# EAGLE design DIP_REFLOW (EAGLE 6.4)
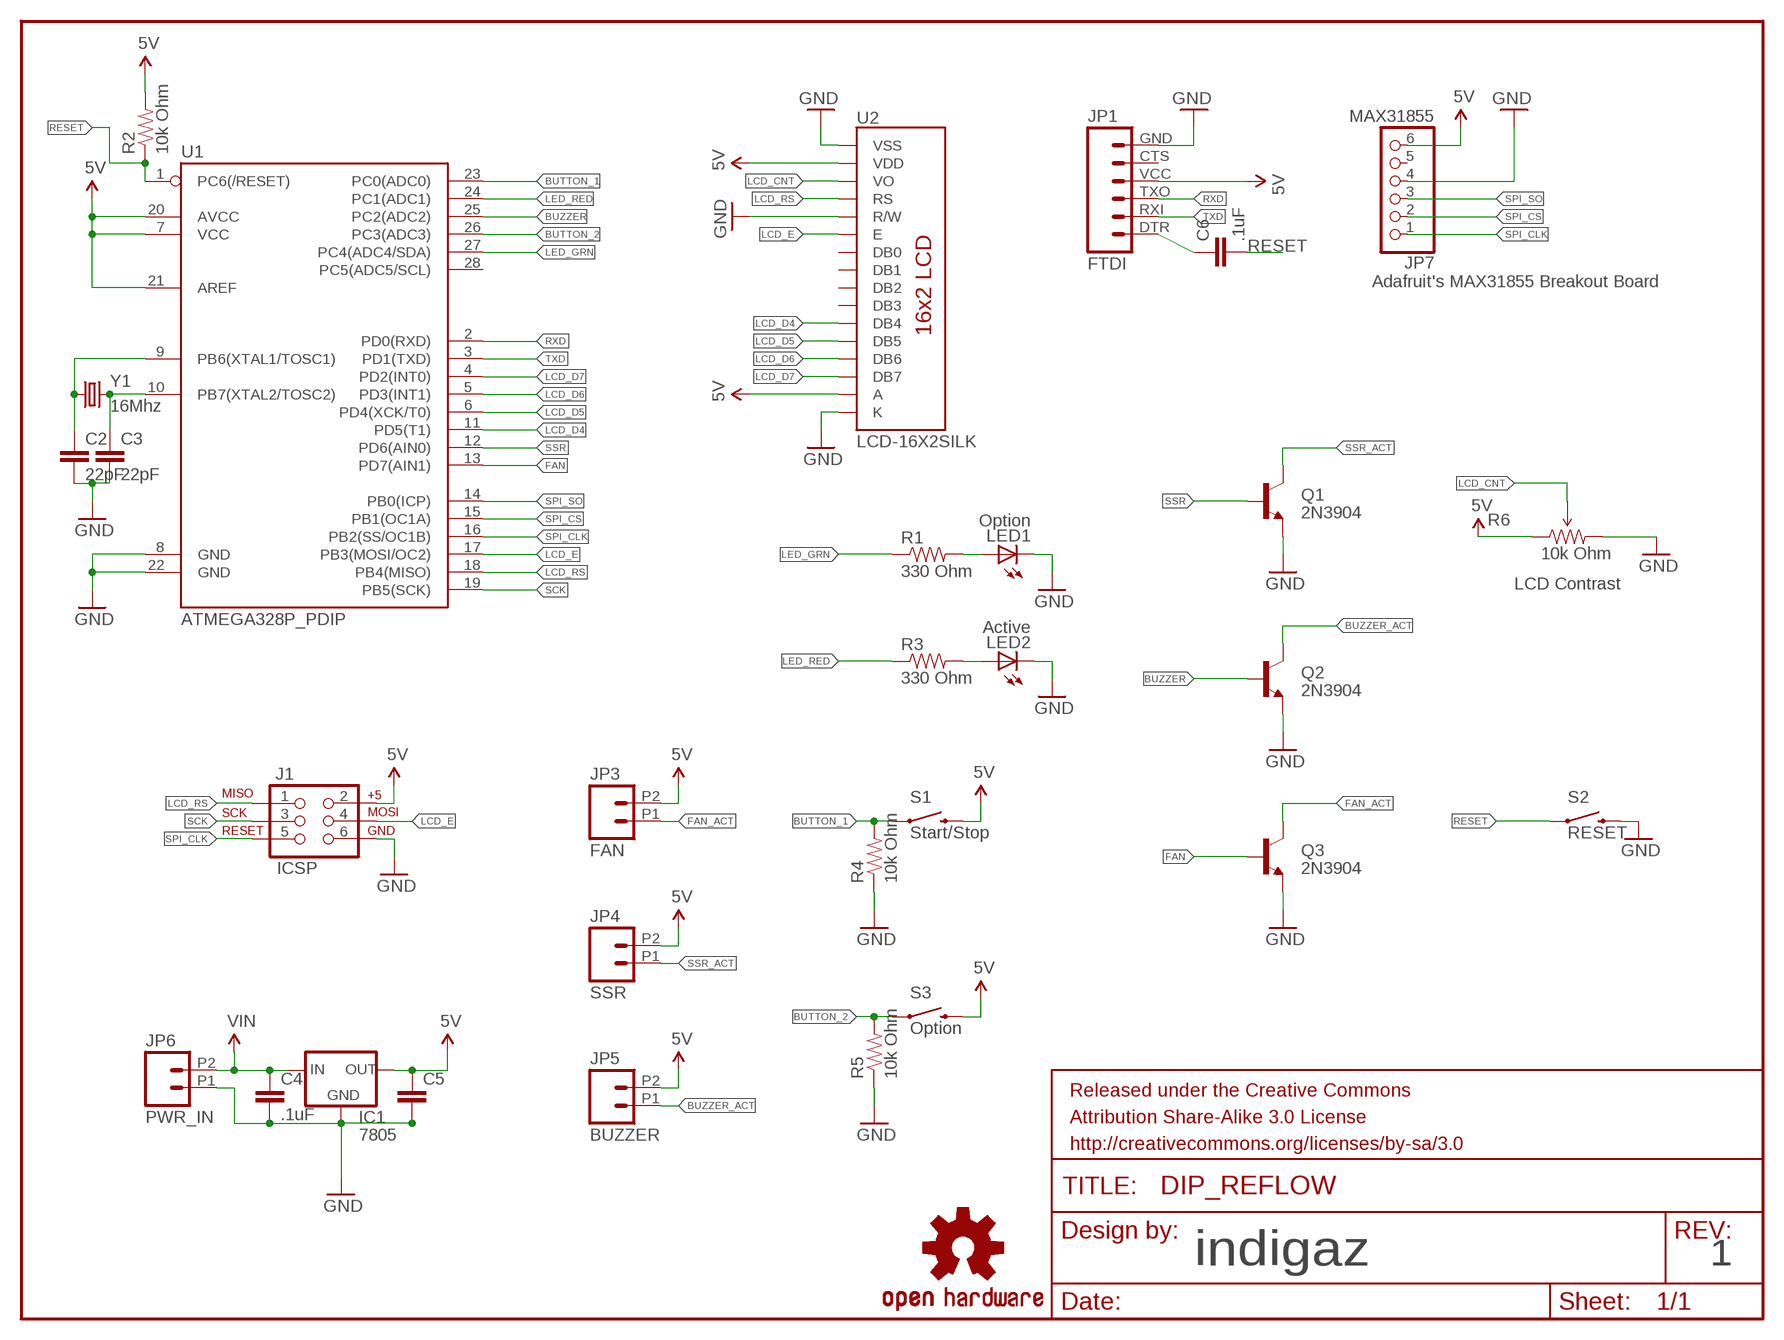
[diagram p0: schematic, sheet 1]

## Parts
C2  22pF  CAPPTH1  [CAP-PTH-5MM]
C3  22pF  CAPPTH1  [CAP-PTH-5MM]
C4  .1uF  CAPPTH1  [CAP-PTH-5MM]
C5  CAPPTH1  [CAP-PTH-5MM]
C6  .1uF  CAPPTH1  [CAP-PTH-5MM]
FRAME1  FRAME-LETTER  [CREATIVE_COMMONS]
IC1  7805  V_REG_78XX-TO-220  [TO-220-ALT]
J1  ICSP  AVR_SPI_PRG_6PTH  [2X3]
JP1  FTDI  FTDI_BASICPTH  [FTDI_BASIC]
JP3  FAN  M022.54MM_SCREWTERM  [1X02_2.54_SCREWTERM]
JP4  SSR  M022.54MM_SCREWTERM  [1X02_2.54_SCREWTERM]
JP5  BUZZER  M022.54MM_SCREWTERM  [1X02_2.54_SCREWTERM]
JP6  PWR_IN  M022.54MM_SCREWTERM  [1X02_2.54_SCREWTERM]
JP7  MAX31855  PINHD-1X6  [1X06]
LED1  Option  LED5MM  [LED5MM]
LED2  Active  LED5MM  [LED5MM]
LOGO1  OSHW-LOGOL  [OSHW-LOGO-L]
Q1  2N3904  TRANSISTOR_NPNTO-92-AMMO  [TO-92-AMMO]
Q2  2N3904  TRANSISTOR_NPNTO-92-AMMO  [TO-92-AMMO]
Q3  2N3904  TRANSISTOR_NPNTO-92-AMMO  [TO-92-AMMO]
R1  330 Ohm  RESISTORPTH-1/4W  [AXIAL-0.4]
R2  10k Ohm  RESISTORPTH-1/4W  [AXIAL-0.4]
R3  330 Ohm  RESISTORPTH-1/4W  [AXIAL-0.4]
R4  10k Ohm  RESISTORPTH-1/4W  [AXIAL-0.4]
R5  10k Ohm  RESISTORPTH-1/4W  [AXIAL-0.4]
R6  10k Ohm  TRIMPOT-PTH-KNOB  [3386U]
S1  Start/Stop  SWITCH-MOMENTARY-2PTH  [TACTILE-PTH]
S2  RESET  SWITCH-MOMENTARY-2PTH  [TACTILE-PTH]
S3  Option  SWITCH-MOMENTARY-2PTH  [TACTILE-PTH]
U1  ATMEGA328P_PDIP  [DIL28-3]
U2  LCD-16X2SILK  [LCD-16X2]
Y1  16Mhz  CRYSTALHC49US  [HC49US]

## Nets
5V: C5.1 IC1.OUT J1.2 JP1.VCC JP3.P2 JP4.P2 JP5.P2 JP7.6 R2.P$2 R6.1(CCW) S1.3 S3.3 U1.7(VCC) U1.20(AVCC) U1.21(AREF) U2.2(VDD) U2.15(A)
BUTTON_1: R4.P$2 S1.1 U1.23(PC0(ADC0))
BUTTON_2: R5.P$2 S3.1 U1.26(PC3(ADC3))
BUZZER: Q2.2(B) U1.25(PC2(ADC2))
BUZZER_ACT: JP5.P1 Q2.3(C)
FAN: Q3.2(B) U1.13(PD7(AIN1))
FAN_ACT: JP3.P1 Q3.3(C)
GND: C2.2 C3.2 C4.2 C5.2 IC1.GND J1.6 JP1.GND JP6.P1 JP7.4 LED1.K(C) LED2.K(C) Q1.1(E) Q2.1(E) Q3.1(E) R4.P$1 R5.P$1 R6.3(CW) S2.3 U1.8(GND) U1.22(GND) U2.1(VSS) U2.5(R/W) U2.16(K)
LCD_CNT: R6.2(WIPER) U2.3(VO)
LCD_D4: U1.11(PD5(T1)) U2.11(DB4)
LCD_D5: U1.6(PD4(XCK/T0)) U2.12(DB5)
LCD_D6: U1.5(PD3(INT1)) U2.13(DB6)
LCD_D7: U1.4(PD2(INT0)) U2.14(DB7)
LCD_E: J1.4 U1.17(PB3(MOSI/OC2)) U2.6(E)
LCD_RS: J1.1 U1.18(PB4(MISO)) U2.4(RS)
LED_GRN: R1.P$1 U1.27(PC4(ADC4/SDA))
LED_RED: R3.P$1 U1.24(PC1(ADC1))
N$1: C6.1 JP1.DTR
N$2: C2.1 U1.9(PB6(XTAL1/TOSC1)) Y1.1
N$3: LED1.A R1.P$2
N$4: C3.1 U1.10(PB7(XTAL2/TOSC2)) Y1.2
N$5: LED2.A R3.P$2
RESET: C6.2 R2.P$1 S2.1 U1.1(PC6(/RESET))
RXD: JP1.TXO U1.2(PD0(RXD))
SCK: J1.3 U1.19(PB5(SCK))
SPI_CLK: J1.5 JP7.1 U1.16(PB2(SS/OC1B))
SPI_CS: JP7.2 U1.15(PB1(OC1A))
SPI_SO: JP7.3 U1.14(PB0(ICP))
SSR: Q1.2(B) U1.12(PD6(AIN0))
SSR_ACT: JP4.P1 Q1.3(C)
TXD: JP1.RXI U1.3(PD1(TXD))
VIN: C4.1 IC1.IN JP6.P2
Unconnected: JP1.CTS JP7.5 U1.28(PC5(ADC5/SCL)) U2.7(DB0) U2.8(DB1) U2.9(DB2) U2.10(DB3)

## Notes on the sheet
- Adafruit's MAX31855 Breakout Board
- LCD Contrast
- indigaz | 1

## Library data of the parts
C2-C6 = SparkFun-Capacitors:CAP: Capacitor Standard 0603 ceramic capacitor, and 0.1" leaded capacitor.
FRAME1 = SparkFun-Aesthetics:FRAME-LETTER: Schematic Frame Standard 8.5x11 US Letter frame
IC1 = SparkFun-PowerIC:V_REG_78XX: Voltage Regulator Standard 7805 5V regulator. IGO (Input Ground Output). Spark Fun Electronics SKU : COM-00107
J1 = SparkFun-Connectors:AVR_SPI_PRG_6: AVR ISP 6 Pin This is the reduced ISP connector for AVR programming. Common on Arduino. This footprint will take up less PCB space and can be used with a 10-pin to 6-pin adapter such as SKU: BOB-08508
JP1 = SparkFun-Connectors:FTDI_BASIC: FTDI Basic header with labels
JP3-JP6 = SparkFun-Connectors:M02: Standard 2-pin 0.1" header. Use with - straight break away headers ( PRT-00116) - right angle break away headers (PRT-00553) - swiss pins (PRT-00743) - machine pins (PRT-00117) - female headers (PRT-00115) Molex polarized connector foot print use with: PRT-08233 with associated crimp pins and housings. 2.54_SCREWTERM for use with PRT-10571. 3.5mm Screw Terminal footprints for PRT-08084 5mm Screw Terminal footprints for use with PRT-08433
JP7 = adafruit:PINHD-1X6: PIN HEADER
LED1 LED2 = SparkFun-LED:LED: LEDs Standard schematic elements and footprints for 5mm, 3mm, 1206, and 0603 sized LEDs. 5mm - Spark Fun Electronics SKU : COM-00529 (and others)
LOGO1 = SparkFun-Aesthetics:OSHW-LOGO: Open Source Hardware Logo This logo indicates the piece of hardware it is found on incorporates a OSHW license and/or adheres to the definition of open source hardware found here: http://freedomdefined.org/OSHW
Q1-Q3 = SparkFun-DiscreteSemi:TRANSISTOR_NPN: Generic NPN BJT MMBT2222A - TRANS-08049 (SOT-23, 1A 40V) MPSA42 - TRANS-09116 (SOT-23, 500mA 300V) MMBT5088LT1G - TRANS-11160 (SOT-23, 50 mA 30V)
R1-R5 = SparkFun-Resistors:RESISTOR: Resistor Basic schematic elements and footprints for 0603, 1206, and PTH resistors.
R6 = SparkFun-Electromechanical:TRIMPOT: Various small potentiometers for "set-and-forget" applications
S1-S3 = SparkFun-Electromechanical:SWITCH-MOMENTARY-2: Various NO switches- pushbuttons, reed, etc
U1 = SparkFun-DigitalIC:ATMEGA328P_PDIP: uC used in the Arduino 32kb flash, 1k EEPROM, 2k SRAM This is the through-hole version of this chip.
U2 = SparkFun-Displays:LCD-16X2: Standard text-only 16x2 parallel input LCD
Y1 = SparkFun-FreqCtrl:CRYSTAL: Various standard crystals. Proven footprints. Spark Fun Electronics SKU : COM-00534

## Net classes
0 default: width 0.305 mm, drill 0.508 mm, clearance 0.254 mm

## Board
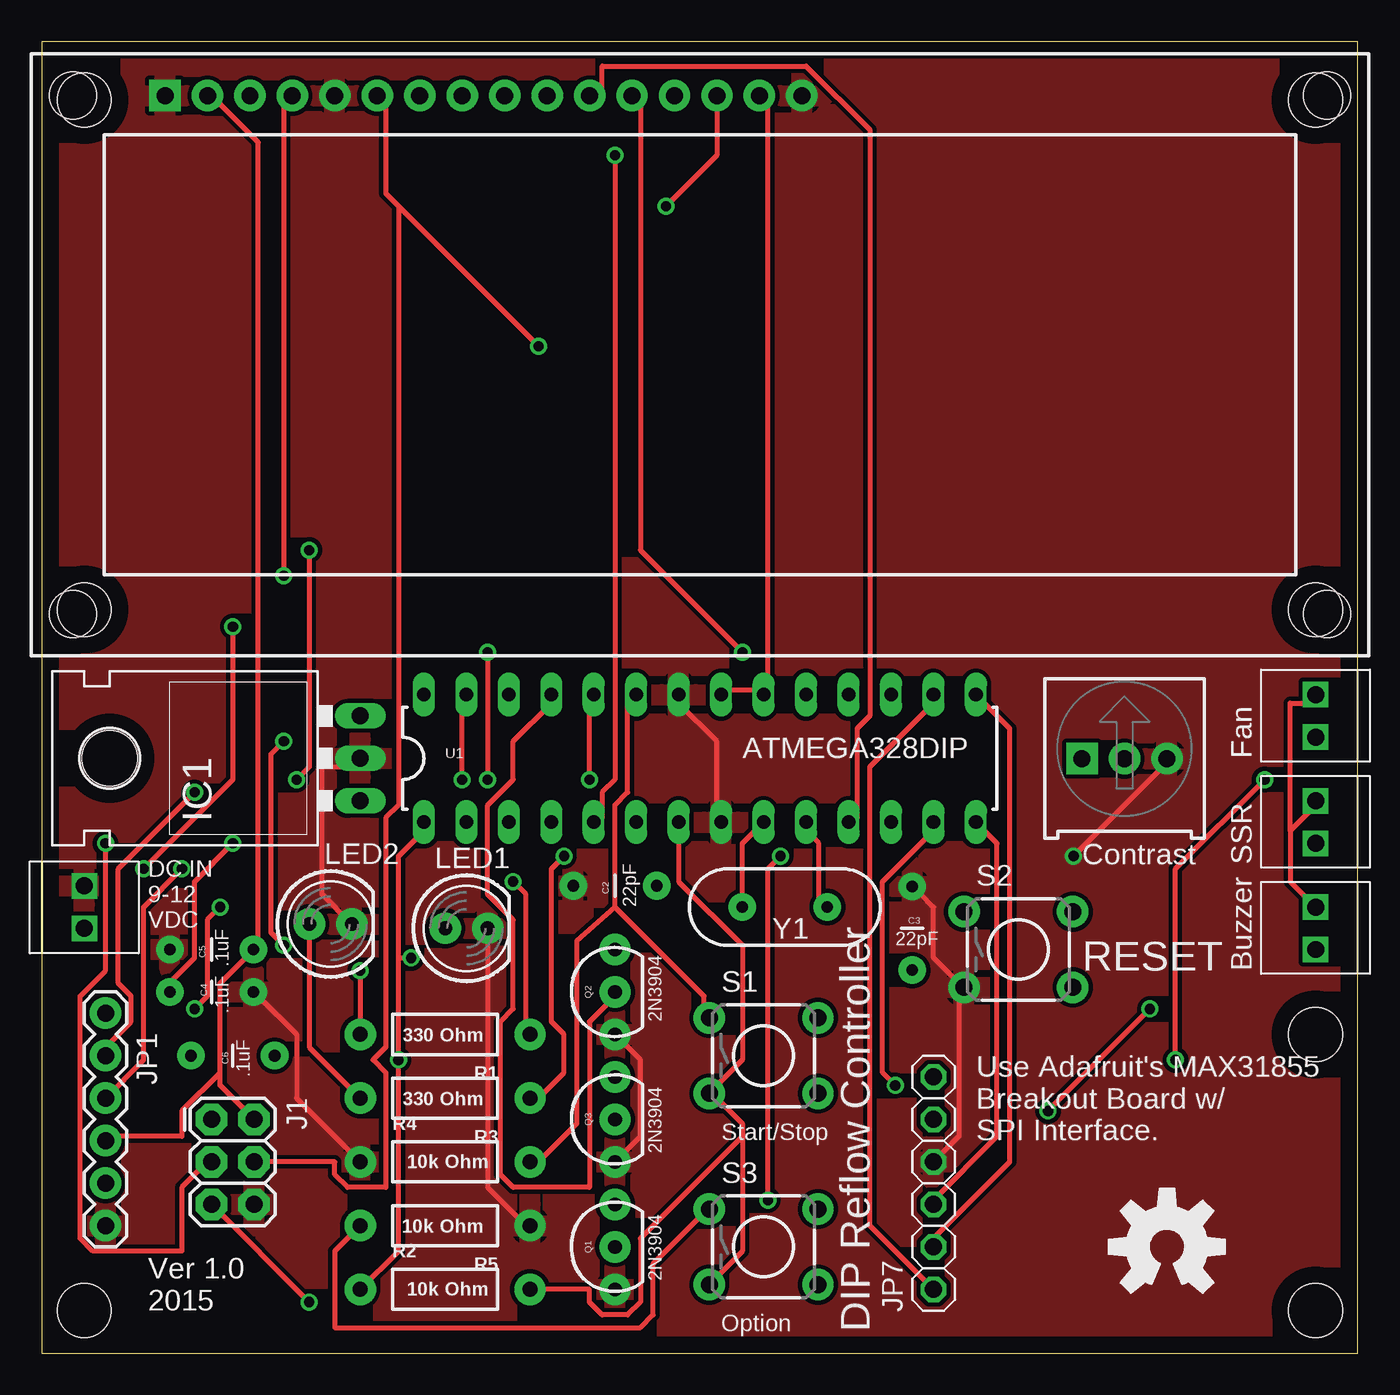
[diagram p1: board, top side]
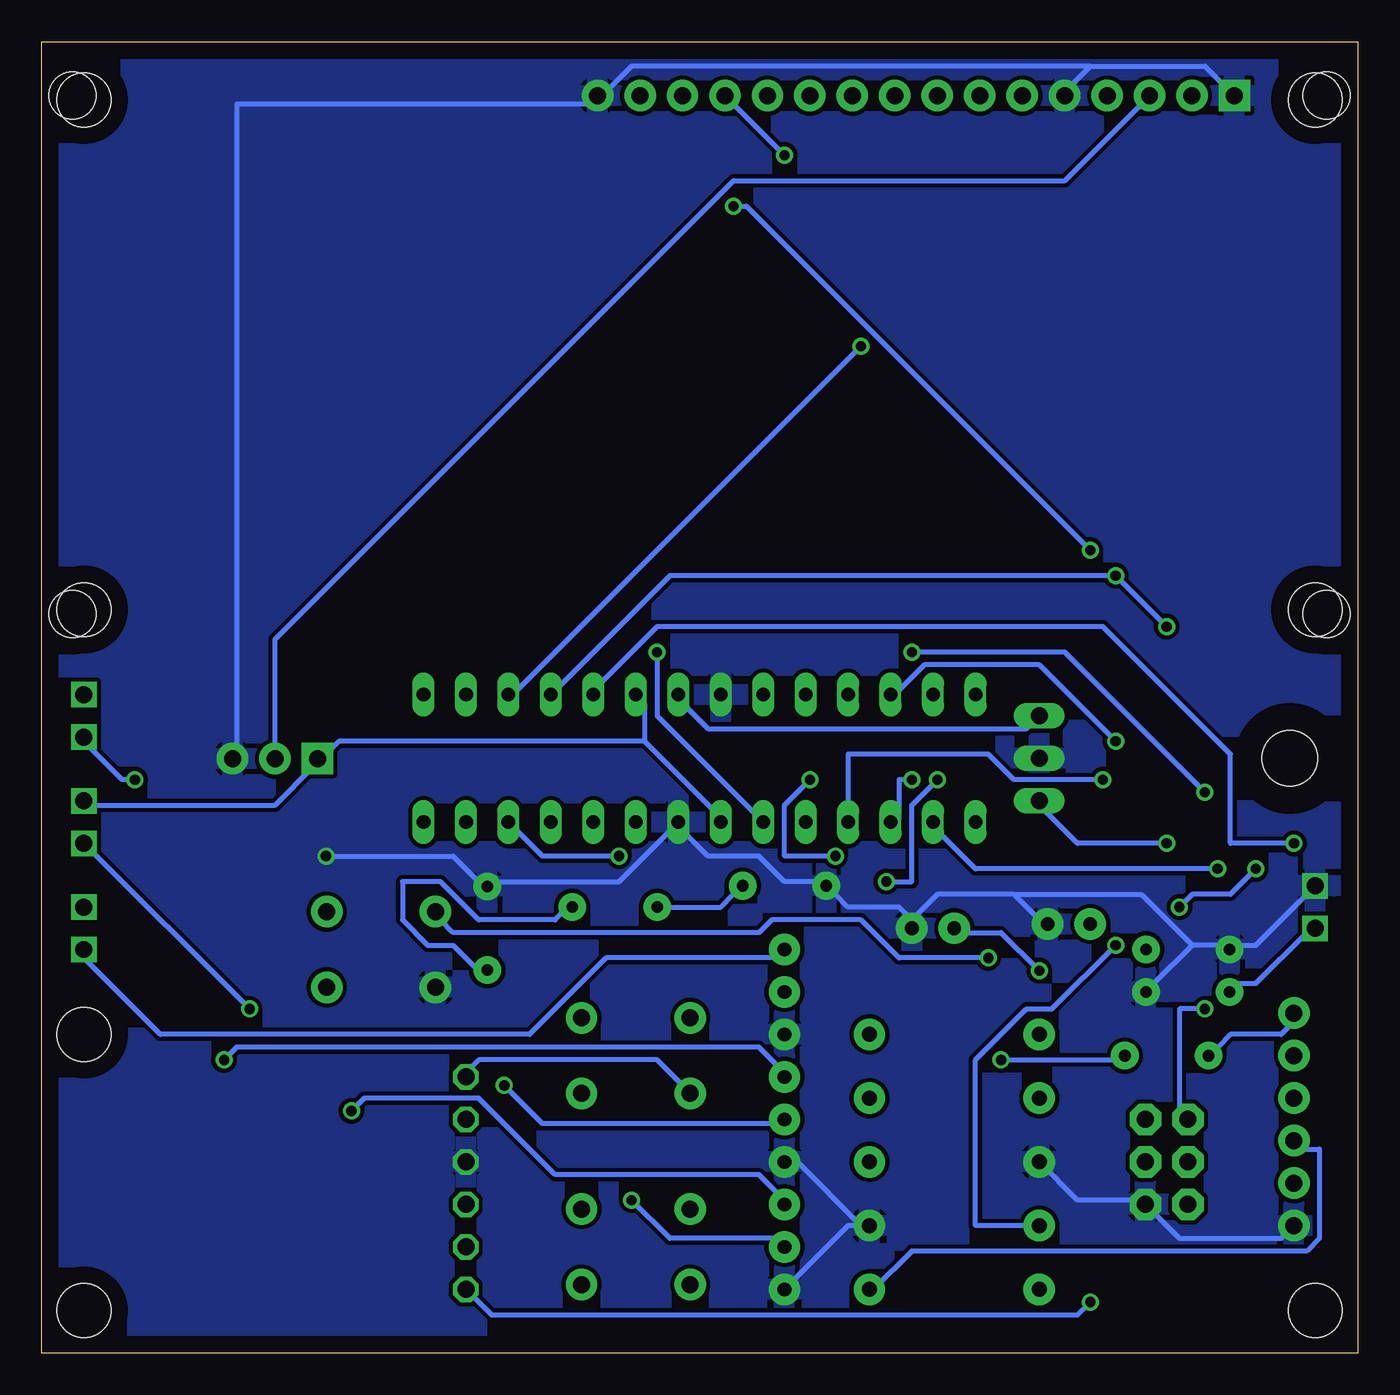
[diagram p2: board, bottom side, seen from below]

Size 78.72 x 78.41 mm. Coordinates in mm from the lower left corner, seen from the top.
Outline: 0,0 78.72,0 78.72,78.41 0,78.41 0,0
Copper layers (1*16): Top 0.035mm / dielectric 1.5mm / Bottom 0.035mm
Design rules "default *": minimum track width 10mil, minimum drill 20mil, track to track 8mil, track to pad 8mil, pad to pad 8mil, via to via 8mil, smd to smd 8mil, copper to edge 40mil, drill to drill 8mil, minimum pad ring 10mil, minimum via ring 8mil, stop-mask expansion 4mil, vias tented up to drill 0mil, thermal gap 10mil
Holes 3.2 mm at 2.54,2.54 76.2,2.54 76.2,74.93 2.54,74.93 2.54,44.45 76.2,44.45 76.2,19.05

### Footprints (pad centres in the part's own frame; a part is rotated, then mirrored left to right if it is on the bottom)
CAP-PTH-5MM = drill 0.7 pad 1.651: 1 -2.5,0; 2 2.5,0
TO-220-ALT = drill 1.016 long: GND 0,-3.81; IN -2.54,-3.81; OUT 2.54,-3.81 | hole 3.302: 0,11.176
2X3 = drill 1.016 pad 1.88 octagon: 1 0,0; 2 0,2.54; 3 2.54,0; 4 2.54,2.54; 5 5.08,0; 6 5.08,2.54
FTDI_BASIC = drill 1.016 pad 1.88: CTS 10.16,0; DTR 0,0; GND 12.7,0; RXI 2.54,0; TXO 5.08,0; VCC 7.62,0
1X02_2.54_SCREWTERM = drill 1.016 square: P1 2.54,0; P2 0,0
1X06 = drill 1.016 octagon: 1 -6.35,0; 2 -3.81,0; 3 -1.27,0; 4 1.27,0; 5 3.81,0; 6 6.35,0
LED5MM = drill 0.813 pad 1.88: A -1.27,0; K 1.27,0
TO-92-AMMO = drill 0.813 pad 1.88: 1 -2.54,0; 2 0,0; 3 2.54,0
AXIAL-0.4 = drill 0.9 pad 1.88: P$1 -5.08,0; P$2 5.08,0
3386U = drill 1.016 pad 1.88 square: 1 -2.54,-0.015 | drill 1.016 pad 1.88: 2 0,-0.015; 3 2.54,-0.015
TACTILE-PTH = drill 1.016 pad 1.88: 1 -3.251,2.261; 2 3.251,2.261; 3 -3.251,-2.261; 4 3.251,-2.261
DIL28-3 = drill 0.813 long: 1 -16.51,-3.81; 2 -13.97,-3.81; 3 -11.43,-3.81; 4 -8.89,-3.81; 5 -6.35,-3.81; 6 -3.81,-3.81; 7 -1.27,-3.81; 8 1.27,-3.81; 9 3.81,-3.81; 10 6.35,-3.81; 11 8.89,-3.81; 12 11.43,-3.81; 13 13.97,-3.81; 14 16.51,-3.81; 15 16.51,3.81; 16 13.97,3.81; 17 11.43,3.81; 18 8.89,3.81; 19 6.35,3.81; 20 3.81,3.81; 21 1.27,3.81; 22 -1.27,3.81; 23 -3.81,3.81; 24 -6.35,3.81; 25 -8.89,3.81; 26 -11.43,3.81; 27 -13.97,3.81; 28 -16.51,3.81
LCD-16X2 = drill 1.016 pad 1.88 square: 1 -32,15.5 | drill 1.016 pad 1.88: 2 -29.46,15.5; 3 -26.92,15.5; 4 -24.38,15.5; 5 -21.84,15.5; 6 -19.3,15.5; 7 -16.76,15.5; 8 -14.22,15.5; 9 -11.68,15.5; 10 -9.14,15.5; 11 -6.6,15.5; 12 -4.06,15.5; 13 -1.52,15.5; 14 1.02,15.5; 15 3.56,15.5; 16 6.1,15.5 | hole 2.8: -37.5,15.5; -37.5,-15.5; 37.5,15.5; 37.5,-15.5
HC49US = drill 0.7 pad 1.651: 1 -2.54,0; 2 2.54,0

### Placement (x,y rotation side)
C2  34.29,27.94 180 top
C3  52.07,25.4 90 top
C4  10.16,21.59 0 top
C5  10.16,24.13 180 top
C6  11.43,17.78 0 top
FRAME1  20.32,-7.62 0 top  (outside the outline)
IC1  15.24,35.56 90 top
J1  10.16,13.97 270 top
JP1  3.81,20.32 270 top
JP3  76.2,39.37 270 top
JP4  76.2,33.02 270 top
JP5  76.2,26.67 270 top
JP6  2.54,25.4 90 top
JP7  53.34,10.16 90 top
LED1  25.4,25.4 0 top
LED2  17.27,25.65 0 top
LOGO1  67.31,6.35 0 top
Q1  34.29,6.35 90 top
Q2  34.29,21.59 90 top
Q3  34.29,13.97 90 top
R1  24.13,19.05 180 top
R2  24.13,3.81 0 top
R3  24.13,15.24 180 top
R4  24.13,11.43 0 top
R5  24.13,7.62 180 top
R6  64.77,35.56 0 top
S1  43.18,17.78 0 top
S2  58.42,24.13 0 top
S3  43.18,6.35 0 top
U1  39.37,35.56 0 top
U2  39.37,59.69 0 top
Y1  44.45,26.67 0 top

### Tracks (layer width: path | path; a pad name or v marks a point on that pad's centre or on a via)
5V
  Top 0.305: 10.67,16.76 10.67,16 J1.2 | 10.67,16.76 10.67,22.1 12.19,23.62 C5.1 12.95,24.38 12.95,72.39 10.67,74.68 U2.2 | 10.67,16.76 8.38,14.48 8.38,12.95 3.81,12.95 JP1.VCC | JP5.P2 74.68,28.19 74.68,31.24 | 74.68,31.24 76.2,32.77 JP4.P2 | 74.68,31.24 74.68,38.86 76.2,38.86 JP3.P2 | 41.91,12.95 41.91,13.72 40.39,15.24 S1.3 40.39,16 41.91,17.53 41.91,24.38 38.1,28.19 U1.7 | 41.91,12.95 41.91,6.1 40.39,4.57 S3.3 | U1.21 41.15,39.62 42.67,39.62 U1.20 43.43,39.62 43.43,74.68 U2.15 | R2.P$2 32.77,3.81 32.77,3.05 33.53,2.29 35.05,2.29 35.81,3.05 35.81,6.86 41.91,12.95
  Bottom 0.305: R2.P$2 28.96,3.81 26.67,6.1 3.05,6.1 2.29,6.86 2.29,12.19 3.81,12.19 JP1.VCC | JP4.P2 76.2,32.77 64.77,32.77 62.48,35.05 R6.1 61.72,35.81 60.96,36.58 42.67,36.58 | JP7.6 53.34,16.76 52.58,17.53 41.91,17.53 40.39,16 S1.3 | 42.67,36.58 38.1,32 U1.7 | 42.67,36.58 42.67,38.86 U1.20 | IC1.OUT 19.81,37.34 38.86,37.34 40.39,38.86 U1.21
BUTTON_1
  Top 0.305: 34.29,26.67 34.29,32.77 35.05,33.53 35.05,38.86 U1.23 | 34.29,26.67 39.62,21.34 39.62,20.57 S1.1 | 34.29,26.67 32,24.64 32,13.72 29.72,11.43 R4.P$2
BUTTON_2  (via drill 0.61)
  Top 0.305: v14.48,36.58 13.72,35.81 13.72,25.15 v14.48,24.38 | R5.P$2 17.53,6.1 17.53,1.52 35.81,1.52 36.58,2.29 36.58,5.33 39.62,8.38 S3.1
  Bottom 0.305: v14.48,36.58 19.05,41.15 25.91,41.15 27.43,39.62 U1.26 | v14.48,24.38 18.29,20.57 19.81,20.57 22.86,17.53 22.86,7.62 R5.P$2
BUZZER
  Top 0.305: U1.25 30.48,38.86 28.19,36.58 28.19,34.29 26.67,32.77 26.67,27.43 28.19,25.91 28.19,20.57 27.43,19.81 27.43,10.67 28.19,9.91 32.77,9.91 32.77,19.81 34.29,21.34 Q2.2
BUZZER_ACT
  Bottom 0.305: JP5.P1 76.2,23.62 71.63,19.05 49.53,19.05 44.96,23.62 34.29,23.62 Q2.3
FAN  (via drill 0.61)
  Top 0.305: v51.05,16 50.29,16.76 50.29,28.19 53.34,31.24 U1.13
  Bottom 0.305: v51.05,16 48.77,13.72 34.29,13.72 Q3.2
FAN_ACT  (via drill 0.61)
  Top 0.305: v73.15,34.29 67.82,28.96 v67.82,17.53
  Bottom 0.305: v73.15,34.29 73.91,34.29 76.2,36.58 JP3.P1 | v67.82,17.53 67.06,18.29 35.81,18.29 34.29,16.76 Q3.3
GND  (via drill 0.61)
  Top 0.305: U1.22 38.1,38.86 40.39,36.58 40.39,32 U1.8 | JP7.4 54.86,12.95 54.86,21.34 S2.3 54.86,22.1 53.34,23.62 53.34,26.67 52.58,27.43 C3.2 | Q2.1 35.81,17.53 35.81,12.95 Q3.1 | LED2.K 16.76,27.43 16.76,35.05 19.05,35.05 IC1.GND | R4.P$1 15.24,15.24 15.24,19.05 12.95,21.34 C4.2 | LED1.K 26.67,9.91 28.96,7.62 R5.P$1 | v61.72,29.72 67.06,35.05 R6.3
  Bottom 0.305: 29.72,7.62 33.53,11.43 Q3.1 | Q1.1 30.48,7.62 29.72,7.62 | 29.72,7.62 R5.P$1 | JP1.GND 4.57,6.86 10.67,6.86 J1.6 12.95,9.14 16.76,9.14 R4.P$1 | JP6.P1 6.1,24.38 7.62,24.38 C5.2 8.38,24.38 9.91,24.38 | 9.91,24.38 12.19,22.1 C4.2 | 26.67,25.91 27.43,26.67 30.48,26.67 31.24,27.43 C2.2 32,28.19 34.29,28.19 35.81,29.72 38.86,29.72 40.39,31.24 U1.8 44.2,28.19 51.82,28.19 C3.2 52.58,28.19 54.1,29.72 v61.72,29.72 | 26.67,25.91 25.15,27.43 20.57,27.43 | 20.57,27.43 19.05,25.91 LED2.K | 26.67,25.91 LED1.K | 9.91,24.38 12.95,27.43 20.57,27.43 | 16,76.96 9.14,76.96 7.62,75.44 U2.1 | 16,76.96 17.53,75.44 U2.5 | 16,76.96 43.43,76.96 44.96,75.44 U2.16 45.72,74.68 67.06,74.68 67.06,35.81 R6.3
  pour Top (isolate 0.254): -2.03,80.26 -2.03,-1.52 79.76,-1.52 79.76,80.26
  pour Bottom (isolate 0.254): -2.54,80.01 -2.54,-1.52 80.26,-1.52 80.26,80.01
LCD_CNT
  Bottom 0.305: R6.2 64.77,42.67 37.34,70.1 17.53,70.1 12.95,74.68 U2.3
LCD_D4
  Top 0.305: U1.11 48.77,32 48.77,37.34 49.53,38.1 49.53,73.15 45.72,76.96 33.53,76.96 33.53,75.44 U2.11
LCD_D5  (via drill 0.61)
  Top 0.305: v41.91,41.91 35.81,48.01 35.81,74.68 U2.12
  Bottom 0.305: U1.6 41.91,38.1 v41.91,41.91
LCD_D6  (via drill 0.61)
  Top 0.305: v34.29,71.63 34.29,34.29 33.53,33.53 33.53,32 U1.5
  Bottom 0.305: v34.29,71.63 37.34,74.68 U2.13
LCD_D7  (via drill 0.61)
  Top 0.305: v15.24,34.29 16,35.05 v16,48.01 | v37.34,68.58 40.39,71.63 40.39,74.68 U2.14
  Bottom 0.305: U1.4 30.48,35.81 22.1,35.81 20.57,34.29 v15.24,34.29 | v16,48.01 36.58,68.58 v37.34,68.58
LCD_E  (via drill 0.61)
  Top 0.305: 21.34,68.58 20.57,69.34 20.57,74.68 U2.6 | 21.34,68.58 v29.72,60.2 | J1.4 17.53,11.43 17.53,10.67 18.29,9.91 20.57,9.91 20.57,16.76 19.81,17.53 20.57,18.29 20.57,32 21.34,32.77 21.34,68.58
  Bottom 0.305: v29.72,60.2 50.29,39.62 U1.17
LCD_RS  (via drill 0.61)
  Top 0.305: v14.48,46.48 14.48,74.68 U2.4 | v9.14,20.57 9.91,21.34 9.91,25.91 v10.67,26.67 | v6.1,28.96 11.43,34.29 v11.43,43.43
  Bottom 0.305: U1.18 41.15,46.48 v14.48,46.48 v11.43,43.43 | v9.14,20.57 10.67,20.57 10.67,14.48 J1.1 | v10.67,26.67 9.91,27.43 7.62,27.43 v6.1,28.96
LED_GRN  (via drill 0.61)
  Top 0.305: v25.15,34.29 25.15,38.86 U1.27 | v28.19,28.19 28.96,27.43 28.96,19.05 R1.P$1
  Bottom 0.305: v25.15,34.29 26.67,32.77 26.67,28.19 v28.19,28.19
LED_RED  (via drill 0.61)
  Top 0.305: v32.77,34.29 32.77,38.86 U1.24 | v31.24,29.72 30.48,28.96 30.48,19.81 31.24,19.05 31.24,16.76 29.72,15.24 R3.P$1
  Bottom 0.305: v32.77,34.29 34.29,32.77 34.29,29.72 v31.24,29.72
N$1
  Bottom 0.305: C6.1 8.38,18.29 7.62,19.05 4.57,19.05 3.81,19.81 JP1.DTR
N$2
  Top 0.305: U1.9 41.91,30.48 Y1.1
  Bottom 0.305: Y1.1 38.1,26.67 37.34,27.43 C2.1
N$3  (via drill 0.61)
  Top 0.305: v19.05,22.86 R1.P$2
  Bottom 0.305: v19.05,22.86 21.34,25.15 23.62,25.15 LED1.A
N$4
  Top 0.305: U1.10 45.72,31.24 46.48,30.48 46.48,26.67 Y1.2
  Bottom 0.305: C3.1 52.58,22.86 54.1,24.38 55.63,24.38 57.15,25.91 57.15,28.19 54.86,28.19 52.58,25.91 48.01,25.91 47.24,26.67 Y1.2
N$5
  Top 0.305: R3.P$2 16,18.29 LED2.A
RESET  (via drill 0.61)
  Top 0.305: 21.34,23.62 v21.34,17.53 21.34,6.1 R2.P$1 | 21.34,23.62 21.34,29.72 22.86,31.24 U1.1 | 21.34,23.62 v22.1,23.62
  Bottom 0.305: v21.34,17.53 14.48,17.53 C6.2 | v22.1,23.62 27.43,23.62 29.72,25.91 35.05,25.91 35.81,25.15 54.1,25.15 54.86,25.91 S2.1
RXD  (via drill 0.61)
  Top 0.305: v8.38,28.96 6.1,26.67 6.1,17.53 JP1.TXO
  Bottom 0.305: v8.38,28.96 22.86,28.96 25.15,31.24 U1.2
SCK  (via drill 0.61)
  Top 0.305: v3.81,30.48 3.81,22.86 2.29,21.34 2.29,6.86 3.05,6.1 8.38,6.1 8.38,9.91 9.91,11.43 J1.3
  Bottom 0.305: v3.81,30.48 7.62,30.48 7.62,35.81 15.24,43.43 41.91,43.43 45.72,39.62 U1.19
SPI_CLK  (via drill 0.61)
  Top 0.305: JP7.1 49.53,7.62 49.53,35.05 53.34,38.86 U1.16 | v16,3.05 J1.5
  Bottom 0.305: v16,3.05 16.76,2.29 51.82,2.29 JP7.1
SPI_CS
  Top 0.305: U1.15 57.91,37.34 57.91,11.43 53.34,6.86 JP7.2
SPI_SO
  Top 0.305: U1.14 57.15,30.48 57.15,12.95 53.34,9.14 JP7.3
SSR  (via drill 0.61)
  Top 0.305: v44.2,29.72 43.43,28.96 v43.43,9.14
  Bottom 0.305: U1.12 48.77,29.72 v44.2,29.72 | v43.43,9.14 41.15,6.86 34.29,6.86 Q1.2
SSR_ACT  (via drill 0.61)
  Top 0.305: v60.2,14.48 v66.29,20.57
  Bottom 0.305: v66.29,20.57 JP4.P1 | v60.2,14.48 59.44,15.24 52.58,15.24 48.01,10.67 35.81,10.67 34.29,9.14 Q1.3
TXD  (via drill 0.61)
  Top 0.305: v26.67,41.91 v26.67,34.29 | v9.14,33.53 4.57,28.96 4.57,22.1 5.33,21.34 5.33,19.81 3.81,18.29 JP1.RXI
  Bottom 0.305: v26.67,34.29 27.43,34.29 27.43,32 U1.3 | v26.67,41.91 17.53,41.91 v9.14,33.53
VIN  (via drill 0.61)
  Top 0.305: v11.43,30.48 9.14,28.19 9.14,23.62 7.62,22.1 C4.1
  Bottom 0.305: JP6.P2 3.05,25.15 6.1,22.1 7.62,22.1 C4.1 | v11.43,30.48 16.76,30.48 19.05,32.77 IC1.IN

### Text on the board
tSilk: ATMEGA328DIP | Fan | Contrast | SSR | 22pF | DC IN / 9-12 / VDC | 22pF | .1uF | RESET | Buzzer | .1uF | 2N3904 | .1uF | Start/Stop | Use Adafruit's MAX31855 / Breakout Board w/ / SPI Interface. | 2N3904 | 2N3904 | Ver 1.0 / 2015 | Option | DIP Reflow Controller